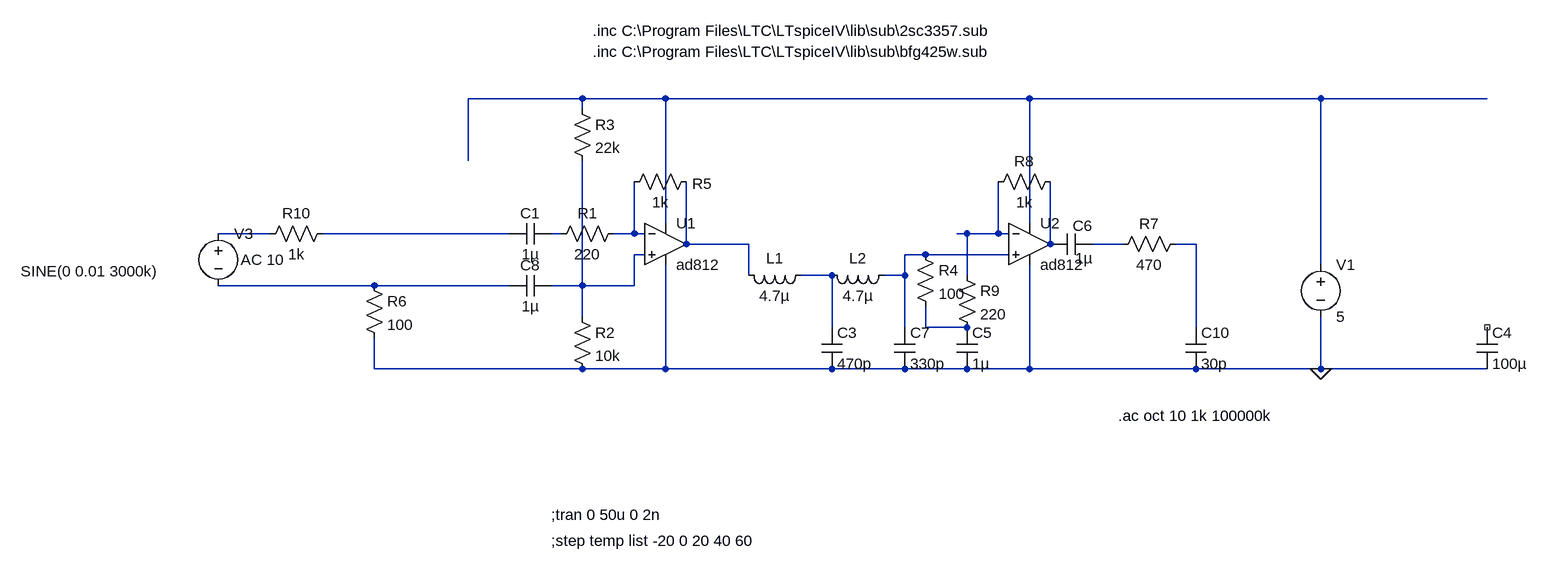
[diagram p0: schematic bb_amp_2.asc]
bb_amp_2.asc, the LTspice schematic file:
Version 4
SHEET 1 1960 904
WIRE 496 -48 320 -48
WIRE 624 -48 496 -48
WIRE 1184 -48 624 -48
WIRE 1632 -48 1184 -48
WIRE 1888 -48 1632 -48
WIRE 496 -32 496 -48
WIRE 320 48 320 -48
WIRE 624 144 624 -48
WIRE 1184 144 1184 -48
WIRE 16 160 -64 160
WIRE 384 160 96 160
WIRE 464 160 448 160
WIRE 576 160 576 80
WIRE 576 160 544 160
WIRE 592 160 576 160
WIRE 1088 160 1072 160
WIRE 1136 160 1136 80
WIRE 1136 160 1088 160
WIRE 1152 160 1136 160
WIRE 656 176 656 80
WIRE 752 176 656 176
WIRE 1216 176 1216 80
WIRE 1328 176 1280 176
WIRE 1440 176 1408 176
WIRE 592 192 576 192
WIRE 1024 192 992 192
WIRE 1152 192 1024 192
WIRE 1632 208 1632 -48
WIRE 752 224 752 176
WIRE 880 224 832 224
WIRE 992 224 992 192
WIRE 992 224 960 224
WIRE 1088 224 1088 160
WIRE 176 240 -64 240
WIRE 384 240 176 240
WIRE 496 240 496 48
WIRE 496 240 448 240
WIRE 576 240 576 192
WIRE 576 240 496 240
WIRE 496 288 496 240
WIRE 880 304 880 224
WIRE 992 304 992 224
WIRE 1024 304 1024 272
WIRE 1088 304 1024 304
WIRE 1440 304 1440 176
WIRE 176 368 176 320
WIRE 496 368 176 368
WIRE 624 368 624 208
WIRE 624 368 496 368
WIRE 880 368 624 368
WIRE 992 368 880 368
WIRE 1088 368 992 368
WIRE 1184 368 1184 208
WIRE 1184 368 1088 368
WIRE 1440 368 1184 368
WIRE 1632 368 1632 288
WIRE 1632 368 1440 368
WIRE 1888 368 1632 368
FLAG 1632 368 0
SYMBOL voltage 1632 192 R0
WINDOW 123 0 0 Left 2
WINDOW 39 0 0 Left 2
SYMATTR InstName V1
SYMATTR Value 5
SYMBOL voltage -64 144 R0
WINDOW 3 -304 74 Left 2
WINDOW 123 34 56 Left 2
WINDOW 39 0 0 Left 2
SYMATTR Value SINE(0 0.01 3000k)
SYMATTR Value2 AC 10
SYMATTR InstName V3
SYMBOL res 672 64 R90
WINDOW 0 35 -8 VBottom 2
WINDOW 3 32 56 VTop 2
SYMATTR InstName R5
SYMATTR Value 1k
SYMBOL res 1232 64 R90
WINDOW 0 0 56 VBottom 2
WINDOW 3 32 56 VTop 2
SYMATTR InstName R8
SYMATTR Value 1k
SYMBOL cap 1072 304 R0
SYMATTR InstName C5
SYMATTR Value 1µ
SYMBOL res 1072 208 R0
SYMATTR InstName R9
SYMATTR Value 220
SYMBOL cap 1280 160 R90
WINDOW 0 3 14 VBottom 2
WINDOW 3 22 12 VTop 2
SYMATTR InstName C6
SYMATTR Value 1µ
SYMBOL cap 864 304 R0
SYMATTR InstName C3
SYMATTR Value 470p
SYMBOL cap 976 304 R0
SYMATTR InstName C7
SYMATTR Value 330p
SYMBOL ind 848 208 R90
WINDOW 0 5 56 VBottom 2
WINDOW 3 32 56 VTop 2
SYMATTR InstName L1
SYMATTR Value 4.7µ
SYMATTR SpiceLine Rser=3
SYMBOL ind 976 208 R90
WINDOW 0 5 56 VBottom 2
WINDOW 3 32 56 VTop 2
SYMATTR InstName L2
SYMATTR Value 4.7µ
SYMATTR SpiceLine Rser=3
SYMBOL cap 1872 304 R0
SYMATTR InstName C4
SYMATTR Value 100µ
SYMBOL res 1424 160 R90
WINDOW 0 0 56 VBottom 2
WINDOW 3 32 56 VTop 2
SYMATTR InstName R7
SYMATTR Value 470
SYMBOL cap 1424 304 R0
SYMATTR InstName C10
SYMATTR Value 30p
SYMBOL ad812 624 176 R0
SYMATTR InstName U1
SYMBOL ad812 1184 176 R0
SYMATTR InstName U2
SYMBOL res 560 144 R90
WINDOW 0 0 56 VBottom 2
WINDOW 3 32 56 VTop 2
SYMATTR InstName R1
SYMATTR Value 220
SYMBOL cap 448 144 R90
WINDOW 0 0 32 VBottom 2
WINDOW 3 32 32 VTop 2
SYMATTR InstName C1
SYMATTR Value 1µ
SYMBOL cap 448 224 R90
WINDOW 0 0 32 VBottom 2
WINDOW 3 32 32 VTop 2
SYMATTR InstName C8
SYMATTR Value 1µ
SYMBOL res 480 272 R0
SYMATTR InstName R2
SYMATTR Value 10k
SYMBOL res 480 -48 R0
SYMATTR InstName R3
SYMATTR Value 22k
SYMBOL res 1008 176 R0
SYMATTR InstName R4
SYMATTR Value 100
SYMBOL res 160 224 R0
SYMATTR InstName R6
SYMATTR Value 100
SYMBOL res 112 144 R90
WINDOW 0 0 56 VBottom 2
WINDOW 3 32 56 VTop 2
SYMATTR InstName R10
SYMATTR Value 1k
TEXT 448 592 Left 2 !;tran 0 50u 0 2n
TEXT 448 632 Left 2 !;step temp list -20 0 20 40 60
TEXT 512 -152 Left 2 !.inc C:\\Program Files\\LTC\\LTspiceIV\\lib\\sub\\2sc3357.sub
TEXT 512 -120 Left 2 !.inc C:\\Program Files\\LTC\\LTspiceIV\\lib\\sub\\bfg425w.sub
TEXT 1320 440 Left 2 !.ac oct 10 1k 100000k

The netlist it stands for:
* bb_amp_2.asc
V1 N001 0 5
V3 N002 N014 SINE(0 0.01 3000k) AC 10
R5 N007 N005 1k
R8 N008 N006 1k
C5 N015 0 1µ
R9 N006 N015 220
C6 N009 N008 1µ
C3 N013 0 470p
C7 N012 0 330p
L1 N013 N007 4.7µ Rser=3
L2 N012 N013 4.7µ Rser=3
C4 NC_01 0 100µ
R7 N010 N009 470
C10 N010 0 30p
* U1: ad812 (symbol ad812 not available, pins judged from their places): In+=N011 In-=N005 V+=N001 V-=0 OUT=N007
* U2: ad812 (symbol ad812 not available, pins judged from their places): In+=N012 In-=N006 V+=N001 V-=0 OUT=N008
R1 N005 N004 220
C1 N004 N003 1µ
C8 N011 N014 1µ
R2 N011 0 10k
R3 N001 N011 22k
R4 N012 N015 100
R6 N014 0 100
R10 N003 N002 1k
;tran 0 50u 0 2n
;step temp list -20 0 20 40 60
.inc C:\Program Files\LTC\LTspiceIV\lib\sub\2sc3357.sub
.inc C:\Program Files\LTC\LTspiceIV\lib\sub\bfg425w.sub
.ac oct 10 1k 100000k
.backanno
.end